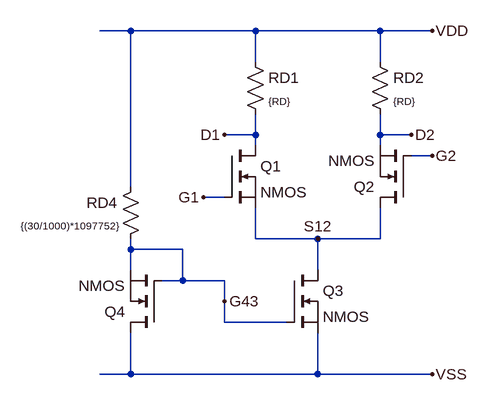
[diagram p0: schematic DifferentialAmplifier.asc]
DifferentialAmplifier.asc, the LTspice schematic file:
Version 4
SHEET 1 880 680
WIRE 64 -80 16 -80
WIRE 256 -80 64 -80
WIRE 448 -80 256 -80
WIRE 528 -80 448 -80
WIRE 256 -32 256 -80
WIRE 448 -32 448 -80
WIRE 256 80 256 48
WIRE 256 80 208 80
WIRE 448 80 448 48
WIRE 496 80 448 80
WIRE 256 96 256 80
WIRE 448 96 448 80
WIRE 528 112 496 112
WIRE 64 160 64 -80
WIRE 208 176 176 176
WIRE 256 240 256 192
WIRE 352 240 256 240
WIRE 448 240 448 192
WIRE 448 240 352 240
WIRE 64 256 64 240
WIRE 144 256 64 256
WIRE 64 288 64 256
WIRE 352 288 352 240
WIRE 144 304 144 256
WIRE 144 304 112 304
WIRE 208 304 144 304
WIRE 208 336 208 304
WIRE 208 368 208 336
WIRE 304 368 208 368
WIRE 64 448 64 384
WIRE 64 448 16 448
WIRE 352 448 352 384
WIRE 352 448 64 448
WIRE 528 448 352 448
FLAG 528 -80 VDD
FLAG 528 448 VSS
FLAG 528 112 G2
FLAG 176 176 G1
FLAG 352 240 S12
FLAG 208 336 G43
FLAG 208 80 D1
FLAG 496 80 D2
SYMBOL nmos 208 96 R0
SYMATTR InstName Q1
SYMBOL nmos 496 192 R180
SYMATTR InstName Q2
SYMBOL res 240 -48 R0
WINDOW 3 36 76 Left 1
SYMATTR Value {RD}
SYMATTR InstName RD1
SYMBOL res 432 -48 R0
WINDOW 3 36 76 Left 1
SYMATTR Value {RD}
SYMATTR InstName RD2
SYMBOL nmos 304 288 R0
SYMATTR InstName Q3
SYMBOL nmos 112 384 R180
SYMATTR InstName Q4
SYMBOL res 80 144 M0
WINDOW 3 36 76 Left 1
SYMATTR Value {(30/1000)*1097752}
SYMATTR InstName RD4

The netlist it stands for:
* DifferentialAmplifier.asc
M§Q1 D1 G1 S12 S12 NMOS
M§Q2 S12 G2 D2 D2 NMOS
RD1 VDD D1 {RD}
RD2 VDD D2 {RD}
M§Q3 S12 G43 VSS VSS NMOS
M§Q4 VSS G43 G43 G43 NMOS
RD4 VDD G43 {(30/1000)*1097752}
.model NMOS NMOS
.model PMOS PMOS
.lib standard.mos
.backanno
.end